# Altium project GateWayPCB.PrjPcb
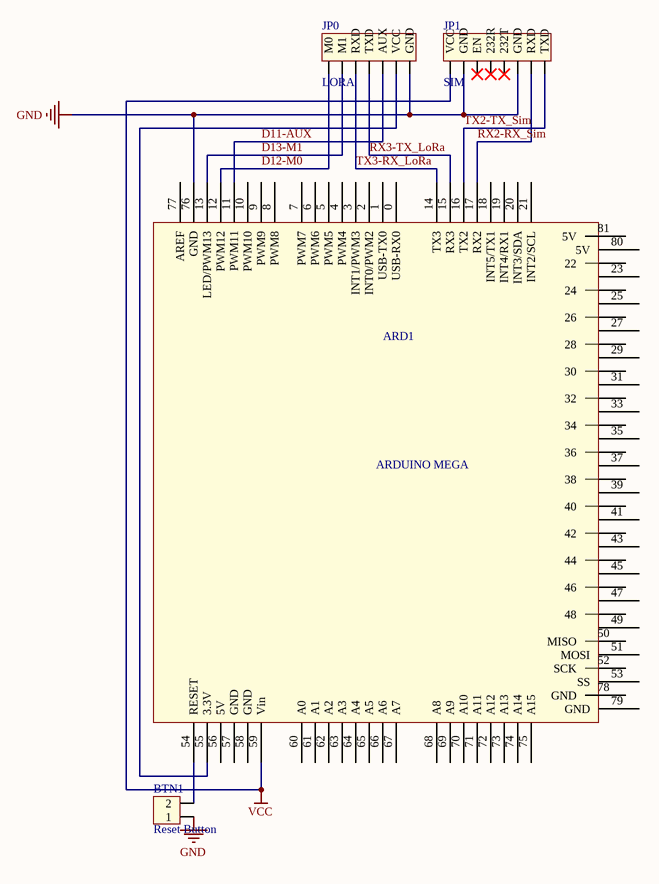
[diagram p0: GateWayMainBoard.SchDoc]
1 sheet, 4 parts. Net scope: global (net labels, ports and power ports of the same name join across sheets).
Board files: GateWayMainBoard.PcbDoc, FinalGateWay.PcbDoc

## Sheet GateWayMainBoard.SchDoc
size A

### Parts
ARD1  ARDUINO MEGA  [Arduino]
BTN1  Reset Button  [HED2]
JP0  LORA  [CON7]
JP1  SIM  [CON8]

### Nets
GND: ARD1.76(GND) BTN1.1 JP0.7(GND) JP1.2(GND) JP1.6(GND)
VCC: ARD1.59(Vin) JP1.1(VCC)
D11-AUX: ARD1.11(PWM11) JP0.5(AUX)
D12-M0: ARD1.12(PWM12) JP0.1(M0)
D13-M1: ARD1.13(LED/PWM13) JP0.2(M1)
RX2-RX_Sim: ARD1.17(RX2) JP1.7(RXD)
RX3-TX_LoRa: ARD1.15(RX3) JP0.4(TXD)
TX2-TX_Sim: ARD1.16(TX2) JP1.8(TXD)
TX3-RX_LoRa: ARD1.14(TX3) JP0.3(RXD)
NetARD1_54: ARD1.54(RESET) BTN1.2
NetARD1_55: ARD1.55(3.3V) JP0.6(VCC)

Not connected (* = marked no-connect by the designer): ARD1 0(USB-RX0) 1(USB-TX0) 2(INT0/PWM2) 3(INT1/PWM3) 4(PWM4) 5(PWM5) 6(PWM6) 7(PWM7) 8(PWM8) 9(PWM9) 10(PWM10) 18(INT5/TX1) 19(INT4/RX1) 20(INT3/SDA) 21(INT2/SCL) 22 23 24 25 26 27 28 29 30 31 32 33 34 35 36 37 38 39 40 41 42 43 44 45 46 47 48 49 50(MISO) 51(MOSI) 52(SCK) 53(SS) 56(5V) 57(GND) 58(GND) 60(A0) 61(A1) 62(A2) 63(A3) 64(A4) 65(A5) 66(A6) 67(A7) 68(A8) 69(A9) 70(A10) 71(A11) 72(A12) 73(A13) 74(A14) 75(A15) 77(AREF) 78(GND) 79(GND) 80(5V) 81(5V); JP1 3(EN)* 4(232R)* 5(232T)*

### Library data of the parts
ARD1 = Arduino
BTN1 = Hed2: Header 2 (Green); Value: Header 2
JP0 = Con7: Connector 7; Value: Connector 7
JP1 = Con8: Connector 8; Value: Connector 8